# Altium schematic sheet [00] - Block Sheet.SchDoc
size A4
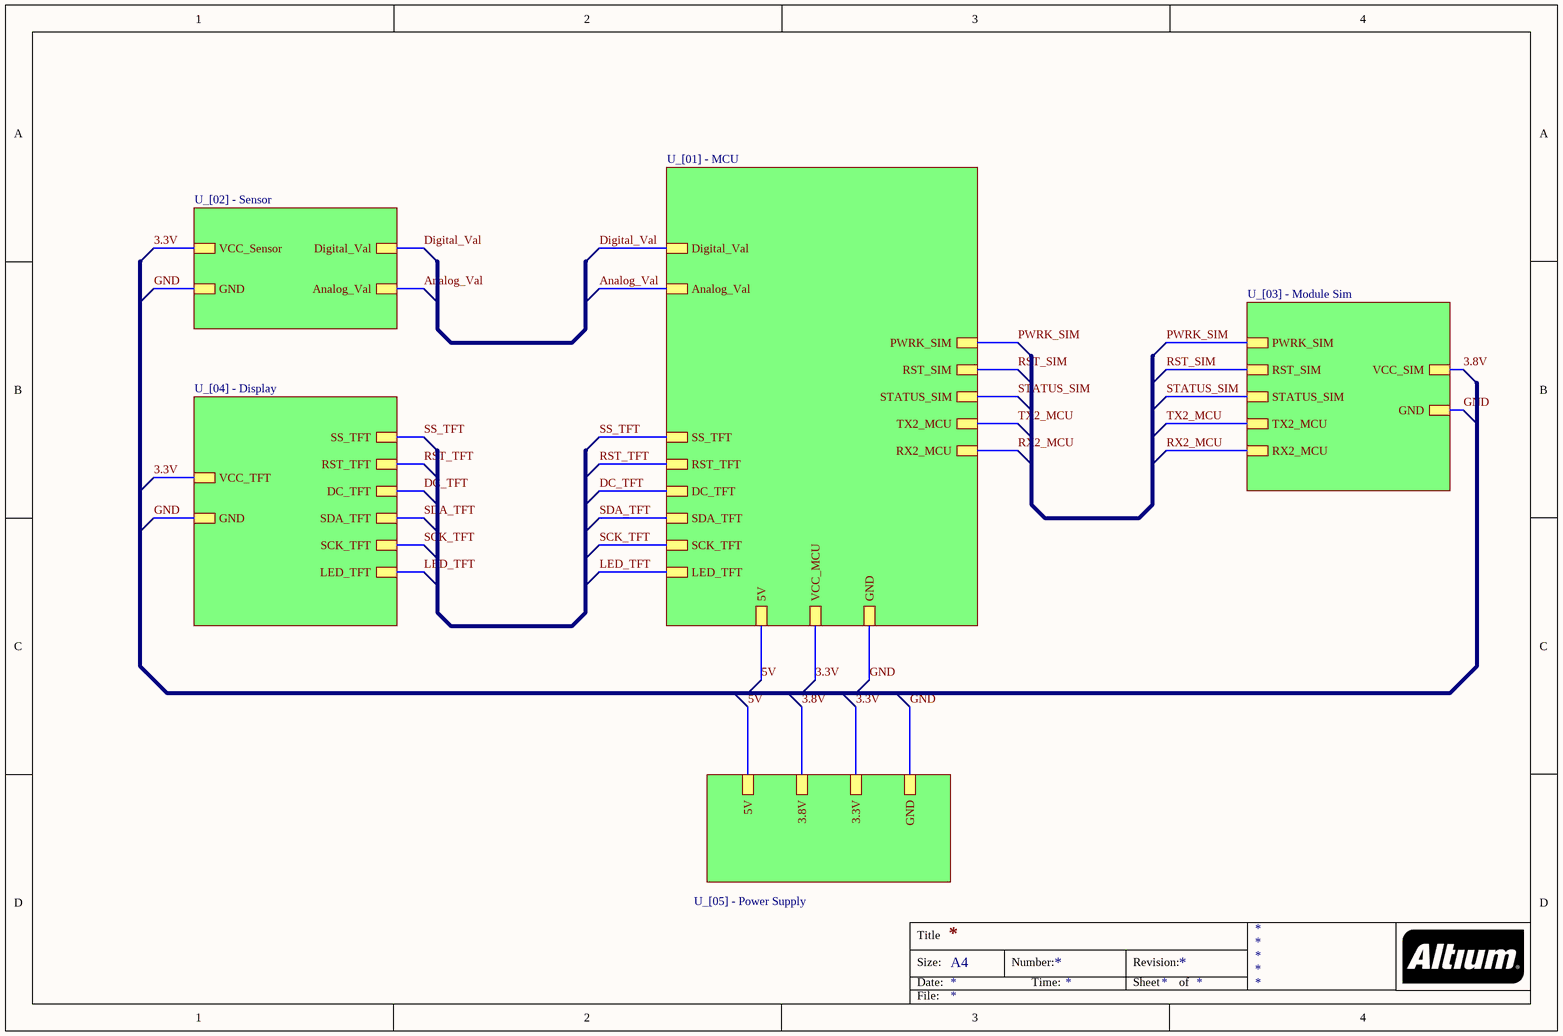
[diagram p0: [00] - Block Sheet.SchDoc]

## Sub-sheets
U_[01] - MCU = [01] - MCU.SchDoc: 5V, VCC_MCU, GND, TX2_MCU, RX2_MCU, PWRK_SIM, RST_SIM, STATUS_SIM, Analog_Val, Digital_Val, SS_TFT, SCK_TFT, SDA_TFT, RST_TFT, DC_TFT, LED_TFT
U_[02] - Sensor = [02] - Sensor.SchDoc: VCC_Sensor, GND, Digital_Val, Analog_Val
U_[03] - Module Sim = [03] - Module Sim.SchDoc: VCC_SIM, PWRK_SIM, RST_SIM, GND, STATUS_SIM, TX2_MCU, RX2_MCU
U_[04] - Display = [04] - Display.SchDoc: VCC_TFT, GND, SS_TFT, RST_TFT, DC_TFT, SDA_TFT, SCK_TFT, LED_TFT
U_[05] - Power Supply = [05] - Power Supply.SchDoc: 3.3V, GND, 5V, 3.8V

## Nets
3.3V: sheet U_[01] - MCU/VCC_MCU, sheet U_[02] - Sensor/VCC_Sensor, sheet U_[04] - Display/VCC_TFT, sheet U_[05] - Power Supply/3.3V
3.8V: sheet U_[03] - Module Sim/VCC_SIM, sheet U_[05] - Power Supply/3.8V
5V: sheet U_[01] - MCU/5V, sheet U_[05] - Power Supply/5V
Analog_Val: sheet U_[01] - MCU/Analog_Val, sheet U_[02] - Sensor/Analog_Val
DC_TFT: sheet U_[01] - MCU/DC_TFT, sheet U_[04] - Display/DC_TFT
Digital_Val: sheet U_[01] - MCU/Digital_Val, sheet U_[02] - Sensor/Digital_Val
GND: sheet U_[01] - MCU/GND, sheet U_[02] - Sensor/GND, sheet U_[03] - Module Sim/GND, sheet U_[04] - Display/GND, sheet U_[05] - Power Supply/GND
LED_TFT: sheet U_[01] - MCU/LED_TFT, sheet U_[04] - Display/LED_TFT
PWRK_SIM: sheet U_[01] - MCU/PWRK_SIM, sheet U_[03] - Module Sim/PWRK_SIM
RST_SIM: sheet U_[01] - MCU/RST_SIM, sheet U_[03] - Module Sim/RST_SIM
RST_TFT: sheet U_[01] - MCU/RST_TFT, sheet U_[04] - Display/RST_TFT
RX2_MCU: sheet U_[01] - MCU/RX2_MCU, sheet U_[03] - Module Sim/RX2_MCU
SCK_TFT: sheet U_[01] - MCU/SCK_TFT, sheet U_[04] - Display/SCK_TFT
SDA_TFT: sheet U_[01] - MCU/SDA_TFT, sheet U_[04] - Display/SDA_TFT
SS_TFT: sheet U_[01] - MCU/SS_TFT, sheet U_[04] - Display/SS_TFT
STATUS_SIM: sheet U_[01] - MCU/STATUS_SIM, sheet U_[03] - Module Sim/STATUS_SIM
TX2_MCU: sheet U_[01] - MCU/TX2_MCU, sheet U_[03] - Module Sim/TX2_MCU

## Notes on the sheet
- Title
- Size:
- Date:
- A4
- Number:
- Time:
- Revision:
- Sheet
- of
- File: